# Altium schematic sheet MVM_AFE.SchDoc: Title
size 420 x 297 mm; Author: G.Kasprowicz; CompanyName: WUT ISE; DrawnBy: G.Kasprowicz; Organization: WUT ISE; Address1: PW ISE; Address2: Nowowiejska 15/19 00-665 Warsaw; Address3: gkasprow@gmail.com; Revision: 2; SheetNumber: 5; SheetTotal: 5; ModifiedBy: -; CheckedDate: -; Title2: Title 2; DivGrp: WUT ISE; Designer: G.Kasprowicz; ModifiedDate: -; ProjectName: Sensor Box
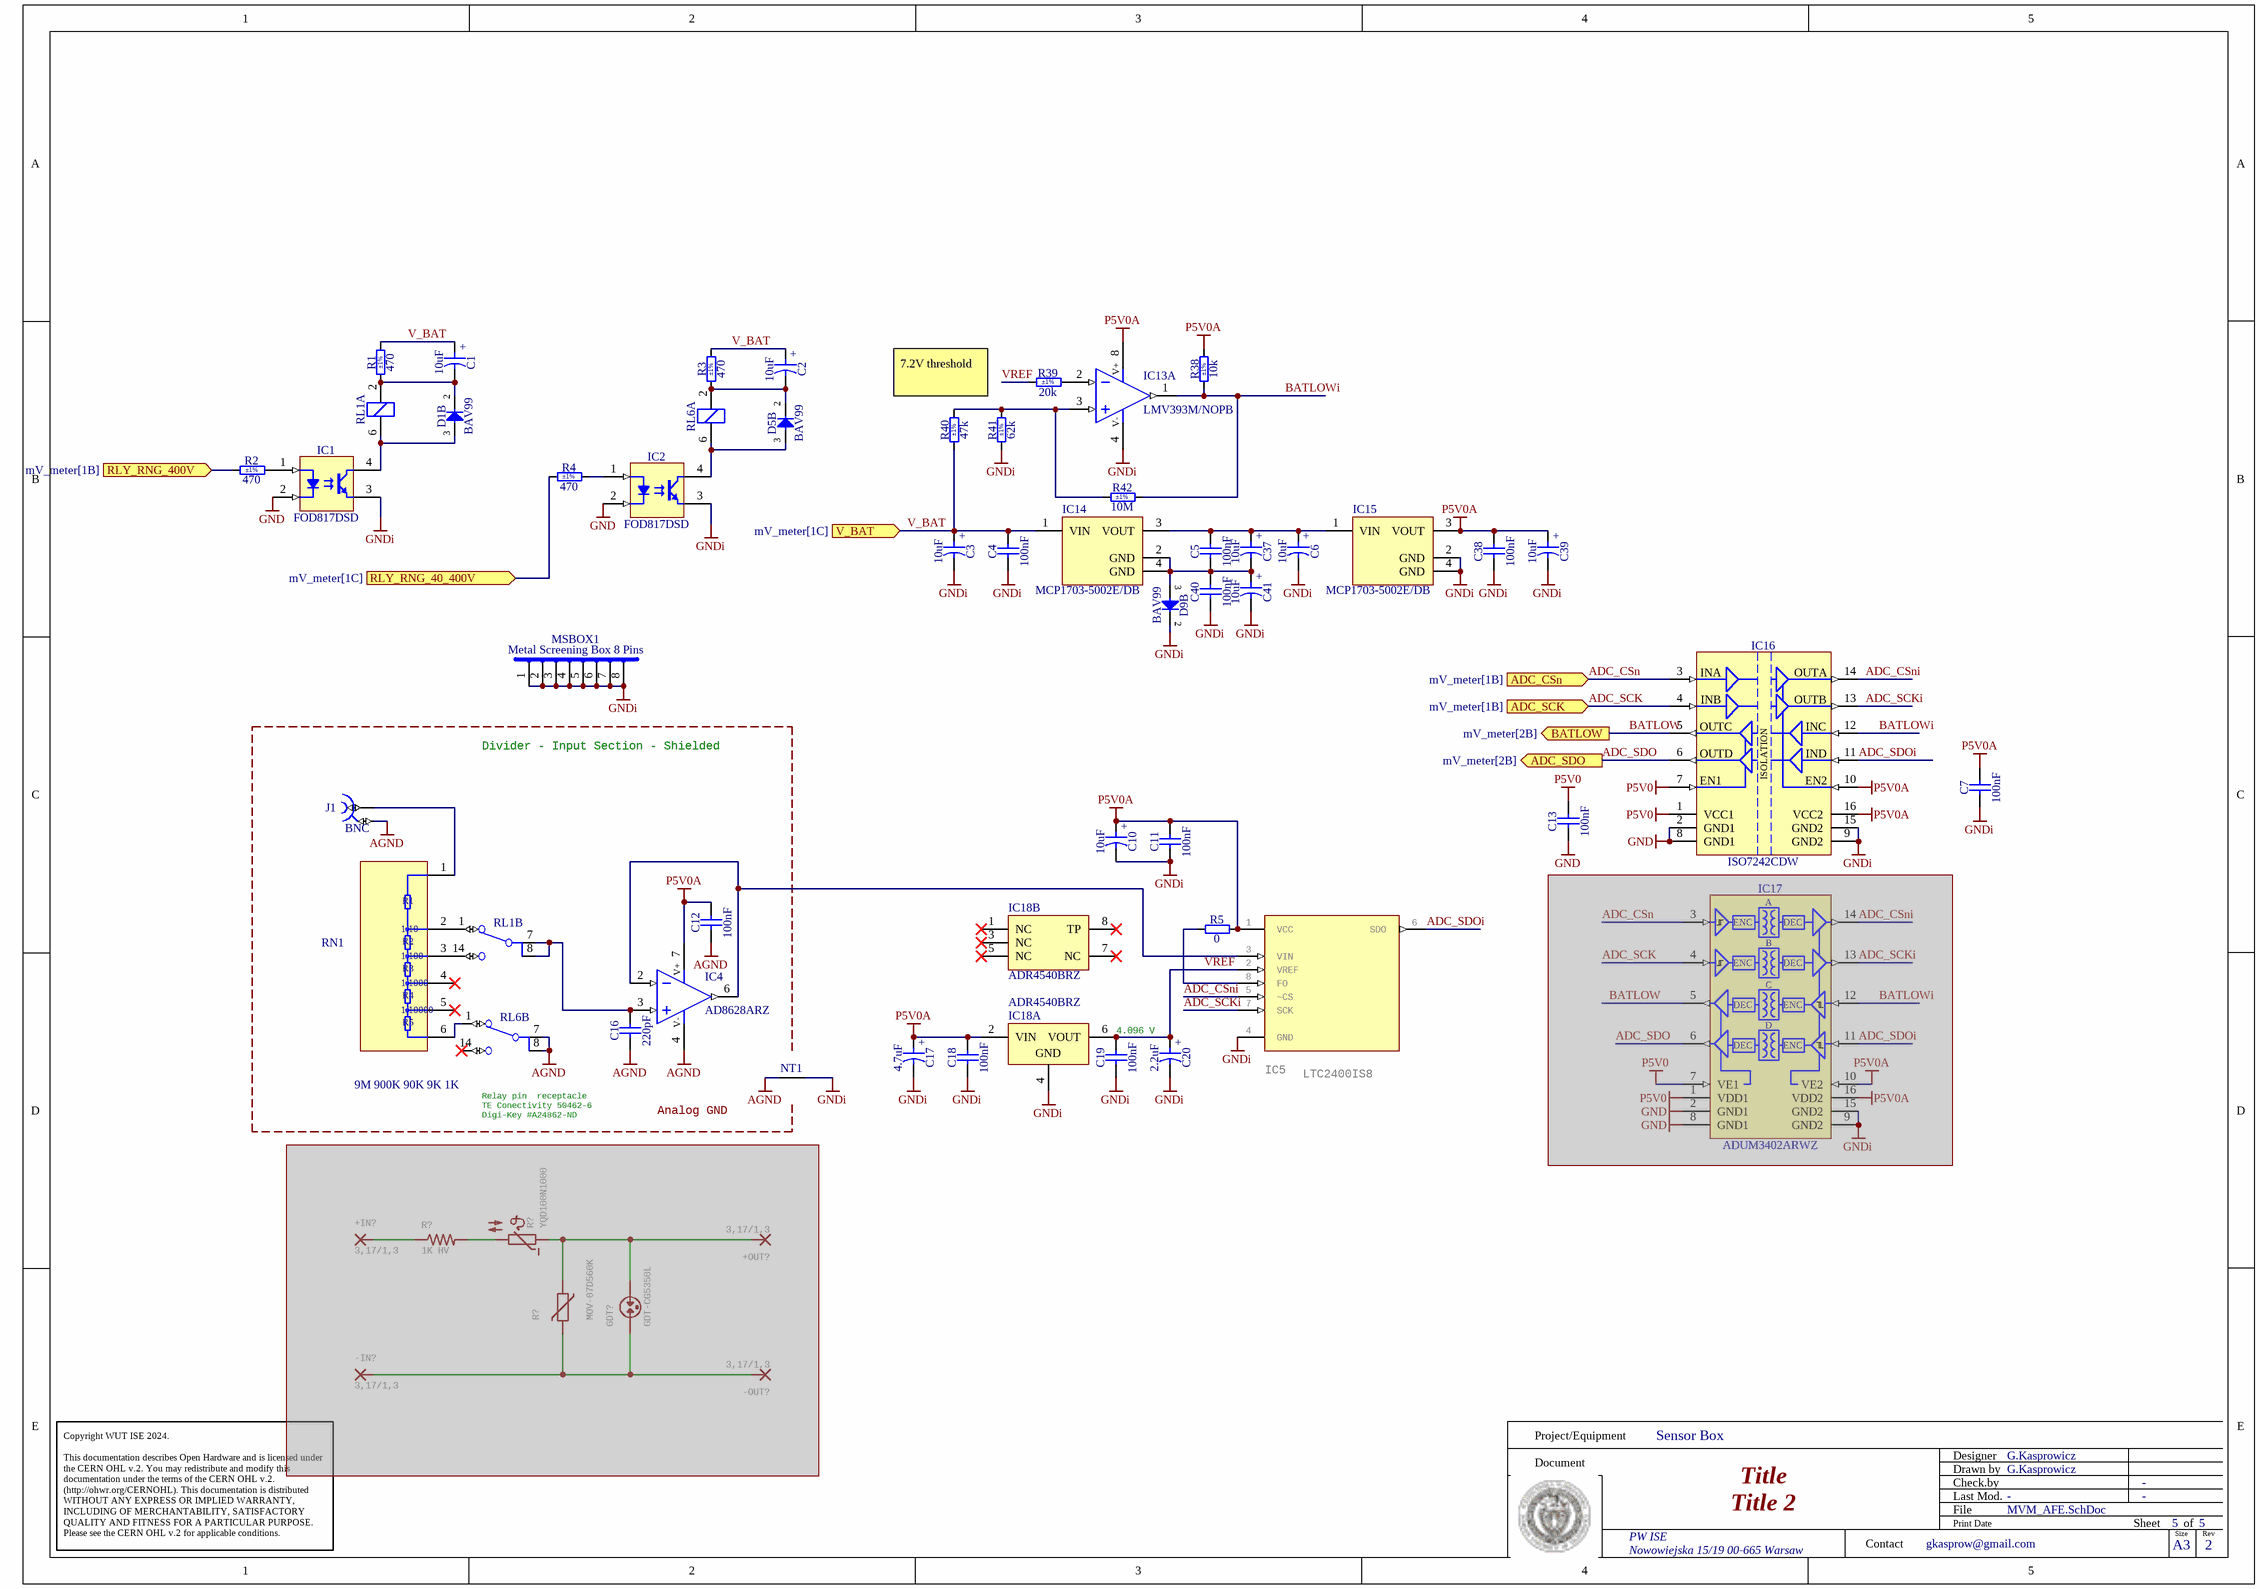
[diagram p0: MVM_AFE.SchDoc]

## Parts
(Parts that share a designator on the sheet are numbered #1, #2 ... from top to bottom, then left to right.)
+IN?  3,17/1,3  [3,17/1,3]  (masked out: inside a compile mask, not in the netlist)
+OUT?  3,17/1,3  [3,17/1,3]  (masked out: inside a compile mask, not in the netlist)
-IN?  3,17/1,3  [3,17/1,3]  (masked out: inside a compile mask, not in the netlist)
-OUT?  3,17/1,3  [3,17/1,3]  (masked out: inside a compile mask, not in the netlist)
C1  10uF  [CAPMP3216X180N]
C2  10uF  [CAPMP3216X180N]
C3  10uF  [CAPMP3216X180N]
C4  100nF  [CAPC2012X88N]
C5  100nF  [CAPC2012X88N]
C6  10uF  [CAPMP3216X180N]
C7  100nF  [CAPC2012X88N]
C10  10uF  [CAPMP3216X180N]
C11  100nF  [CAPC2012X88N]
C12  100nF  [CAPC2012X88N]
C13  100nF  [CAPC2012X88N]
C16  220pF  [CAPC2012X135N]
C17  4.7uF  [CAPMP3216X180N]
C18  100nF  [CAPC2012X88N]
C19  100nF  [CAPC2012X88N]
C20  2.2uF  [CAPMP3216X180N]
C37  10uF  [CAPMP3216X180N]
C38  100nF  [CAPC2012X88N]
C39  10uF  [CAPMP3216X180N]
C40  100nF  [CAPC2012X88N]
C41  10uF  [CAPMP3216X180N]
D1  BAV99  [SOT95P240X110-3N]  (part B of 2)
D5  BAV99  [SOT95P240X110-3N]  (part B of 2)
D9  BAV99  [SOT95P240X110-3N]  (part B of 2)
GDT?  GDT-CG5350L  [CG5350L]  (masked out: inside a compile mask, not in the netlist)
IC1  FOD817DSD  [FAIRCHILD_FOD817DSD]
IC2  FOD817DSD  [FAIRCHILD_FOD817DSD]
IC4  AD8628ARZ  [SOIC127P600X175-8N]
IC5  LTC2400IS8  [SOIC127P600X175-8N]
IC13  LMV393M/NOPB  [SOIC127P600X175-8N]  (part A of 2)
IC14  MCP1703-5002E/DB  [SOT-223-DB3_N]
IC15  MCP1703-5002E/DB  [SOT-223-DB3_N]
IC16  ISO7242CDW  [SOIC127P1030X265-16N]
IC17  ADUM3402ARWZ  [SOIC127P1032X265-16N]  (masked out: inside a compile mask, not in the netlist)
IC18  ADR4540BRZ  [ADI-R-8_M]  (parts A,B of 2)
J1  BNC  [TYCO_1-1337542-0]
MSBOX1  Metal Screening Box 8 Pins  [MSBOX_PERANCEA_PFL6T]
NT1  Net Tie  [Net Tie]  (value not drawn)  (net tie, no BOM)
R1  470  Tolerance: ±1%  [RESC2012X60N]
R2  470  Tolerance: ±1%  [RESC2012X60N]
R3  470  Tolerance: ±1%  [RESC2012X60N]
R4  470  Tolerance: ±1%  [RESC2012X60N]
R5  0  [RESC1608X55N]
R38  10k  Tolerance: ±1%  [RESC1608X55N]
R39  20k  Tolerance: ±1%  [RESC1608X55N]
R40  47k  Tolerance: ±1%  [RESC1608X55N]
R41  62k  Tolerance: ±1%  [RESC1608X55N]
R42  10M  Tolerance: ±1%  [RESC1608X55N]
R?#1  1K HV  [AXIAL-0.6]  (masked out: inside a compile mask, not in the netlist)
R?#2  YQD100N1000  [B57164]  (masked out: inside a compile mask, not in the netlist)
R?#3  MOV-07D560K  [S05K11]  (masked out: inside a compile mask, not in the netlist)
RL1  COMUS 3563.1231.051  [REL_LITTELFUSE_HE700]  (value not drawn)  (parts A,B of 2)
RL6  COMUS 3563.1231.051  [REL_LITTELFUSE_HE700]  (value not drawn)  (parts A,B of 2)
RN1  9M 900K 90K 9K 1K  [1776-C6815]

## Ports
ADC_CSn (in, see mV_meter[1B]), ADC_SCK (in, see mV_meter[1B]), ADC_SDO (out, see mV_meter[2B]), BATLOW (out, see mV_meter[2B]), RLY_RNG_40_400V (in, see mV_meter[1C]), RLY_RNG_400V (in, see mV_meter[1B]), V_BAT (in, see mV_meter[1C])

## Nets
AGND: C12.1 C16.1 IC4.4(V-) J1.2 NT1.1 RL6.7(C) RL6.8(C)
GND: C13.1 IC1.2(C) IC2.2(C) IC16.2(GND1) IC16.8(GND1)
GNDi: C3.2 C4.1 C6.2 C7.1 C10.2 C11.1 C17.2 C18.1 C19.1 C20.2 C38.1 C39.2 C40.1 C41.2 D9.2(C) IC1.3(E) IC2.3(E) IC5.4(GND) IC13.4(V-) IC15.2(GND) IC15.4(GND) IC16.9(GND2) IC16.15(GND2) IC18.4(GND) MSBOX1.1 MSBOX1.2 MSBOX1.3 MSBOX1.4 MSBOX1.5 MSBOX1.6 MSBOX1.7 MSBOX1.8 NT1.2 R41.1
P5V0: C13.2 IC16.1(VCC1) IC16.7(EN1)
P5V0A: C7.2 C10.1 C11.2 C12.2 C17.1 C18.2 C38.2 C39.1 IC4.7(V+) IC5.1(VCC) IC13.8(V+) IC15.3(VOUT) IC16.10(EN2) IC16.16(VCC2) IC18.2(VIN) R5.2 R38.2
ADC_CSn: IC16.3(INA) ; port ADC_CSn
ADC_CSni: IC5.5(~CS) IC16.14(OUTA)
ADC_SCK: IC16.4(INB) ; port ADC_SCK
ADC_SCKi: IC5.7(SCK) IC16.13(OUTB)
ADC_SDO: IC16.6(OUTD) ; port ADC_SDO
ADC_SDOi: IC5.6(SDO) IC16.11(IND)
BATLOW: IC16.5(OUTC) ; port BATLOW
BATLOWi: IC13.1(OUT) IC16.12(INC) R38.1 R42.2
RLY_RNG_40_400V: R4.1 ; port RLY_RNG_40_400V
RLY_RNG_400V: R2.1 ; port RLY_RNG_400V
V_BAT: C1.1 C2.1 C3.1 C4.2 IC14.1(VIN) R1.2 R3.2 R40.1 ; port V_BAT
VREF: C19.2 C20.1 IC5.2(VREF) IC18.6(VOUT) R39.1
NetC1_2: C1.2 D1.2(C) R1.1 RL1.2
NetC2_2: C2.2 D5.2(C) R3.1 RL6.2
NetC5_1: C5.1 C37.2 C40.2 C41.1 D9.3(COMAC) IC14.2(GND) IC14.4(GND)
NetC5_2: C5.2 C6.1 C37.1 IC14.3(VOUT) IC15.1(VIN)
NetC16_2: C16.2 IC4.3(IN+) RL1.7(C) RL1.8(C)
NetD1_3: D1.3(COMAC) IC1.4(C) RL1.6
NetD5_3: D5.3(COMAC) IC2.4(C) RL6.6
NetIC1_1: IC1.1(A) R2.2
NetIC2_1: IC2.1(A) R4.2
NetIC4_2: IC4.2(IN-) IC4.6(OUT) IC5.3(VIN)
NetIC5_8: IC5.8(FO) R5.1
NetIC13_2: IC13.2(IN-) R39.2
NetIC13_3: IC13.3(IN+) R40.2 R41.2 R42.1
NetJ1_1: J1.1 RN1.1
NetRL1_1: RL1.1(NC) RN1.2
NetRL1_14: RL1.14(NO) RN1.3
NetRL6_1: RL6.1(NC) RN1.6

Not connected (* = marked no-connect by the designer): IC18 1(NC)* 3(NC)* 5(NC)* 7(NC)* 8(TP)*; RL6 14(NO)*; RN1 4* 5*

## Notes on the sheet
- 7.2V threshold
- Divider - Input Section - Shielded
- 4.096 V
- Relay pin  receptacle
  TE Conectivity 50462-6
  Digi-Key #A24862-ND
- Analog GND
- Project/Equipment
- Document
- Designer
- Drawn by
- Check.by
- Copyright WUT ISE 2024.
  This documentation describes Open Hardware and is licensed under the CERN OHL v.2. You may redistribute and modify this documentation under the terms of the CERN OHL v.2. (http://ohwr.org/CERNOHL). This documentation is distributed WITHOUT ANY EXPRESS OR IMPLIED WARRANTY, INCLUDING OF MERCHANTABILITY, SATISFACTORY QUALITY AND FITNESS FOR A PARTICULAR PURPOSE. Please see the CERN OHL v.2 for applicable conditions.
- Contact
- File
- Last Mod.
- Print Date
- Sheet
- Size
- A3
- of
- Rev
- (in symbol ADUM3402ARWZ_a) A; ENC; DEC; B; C; D
- (in symbol CTE3216-18_2.2UF_25V_10%) +
- (in symbol CTE3216-18_4.7UF_10V_10%_LESR1400) +
- (in symbol CTE3216-18_10UF_10V_10%_LESR1800) +
- (in symbol ISO7242CDW) ISOLATION
- (in symbol RN_9M_900k_90k_9k_1k_CADDOCK_1776-C6815) R1; 1/10; R2; 1/100; R3; 1/1000; R4; 1/10000; R5

## Library data of the parts
+IN? +OUT? -IN? -OUT? = 3,17/1,3: THROUGH-HOLE PAD; GateName_1: 1; SymbolName_1: PAD; LibraryName: wirepad; DeviceSetName: 3,17/1,3
C1-C3 C6 C10 C37 C39 C41 = CTE3216-18_10UF_10V_10%_LESR1800: Polarised capacitor; Part Description: Low ESR 1R8 Solid Tantalum Chip Capacitor; Manufacturer: GENERIC; Manufacturer1 Part Number: TPSA106K010R1800; Voltage: 10V; Tolerance: ±10%; Part Number: CTE3216-18_10UF_10V_10%_LESR1800; Component Kind: Standard; Component Type: Standard; Pin Count: 2; Value: 10uF; Status: Preferred; Manufacturer Part Number: CTE3216-18_10UF_10V_10%_LESR1800; Case: A; Mounted: Yes; Socket: No; SMD: Yes; Sense: No; Manufacturer1 Example: AVX; Manufacturer1 ComponentHeight: 1.8mm; HelpURL: \\cern.ch\dfs\Applications\Altium\Datasheets\CTE-LESR_AVX_TPS.pdf; Author: CERN DEM JLC; CreateDate: 05.05.2008; LatestRevisionDate: 20.01.2009
C4 C5 C7 C11-C13 C18 C19 C38 C40 = CC0805_100NF_50V_1%_NP0: Non-polarised capacitor; Part Description: SMD Multilayer Chip Ceramic Capacitor; Manufacturer: GENERIC; Manufacturer1 Part Number: 0805N103F500C; Voltage: 50V; TC: C0G/NP0; Tolerance: ±1%; Part Number: CC0805_100NF_50V_1%_NP0; Component Kind: Standard; Component Type: Standard; Footprint: CAPC2012X135N; Pin Count: 2; Value: 100nF; Status: Not Recommended; Manufacturer Part Number: CC0805_100NF_50V_1%_NP0; Case: 0805; Mounted: Yes; Socket: No; SMD: Yes; Sense: No; ComponentHeight: 1.35mm; Manufacturer1 Example: WALSIN TECHNOLOGY CORPORATION; Manufacturer1 ComponentHeight: 1.35mm; HelpURL: \\cern.ch\dfs\Applications\Altium\Datasheets\CC0805_WALSIN_0805.pdf; Author: CERN DEM HF; CreateDate: 28.08.2023; LatestRevisionDate: 28.08.2023
C16 = CC0805_220PF_50V_5%_C0G: Non-polarised capacitor; Part Description: SMD Multilayer Chip Ceramic Capacitor; Manufacturer: GENERIC; Manufacturer1 Part Number: C0805C151J5GACTU; Voltage: 50V; TC: C0G/NP0; Tolerance: ±5%; Part Number: CC0805_220PF_50V_5%_C0G; Component Kind: Standard; Component Type: Standard; Pin Count: 2; Value: 220pF; Status: Preferred; Manufacturer Part Number: CC0805_220PF_50V_5%_C0G; Case: 0805; Mounted: Yes; Socket: No; SMD: Yes; Sense: No; Manufacturer1 Example: KEMET; Manufacturer1 ComponentHeight: 0.88mm; HelpURL: \\cern.ch\dfs\Applications\Altium\Datasheets\CC0805_C0G_KEMET_(Commercial Grade).pdf; Author: CERN DEM JLC; CreateDate: 03.12.2007; LatestRevisionDate: 22.04.2015
C17 = CTE3216-18_4.7UF_10V_10%_LESR1400: Polarised capacitor; Part Description: Low ESR 1R4 Solid Tantalum Chip Capacitor; Manufacturer: GENERIC; Manufacturer1 Part Number: TPSA475K010R1400; Voltage: 10V; Tolerance: ±10%; Part Number: CTE3216-18_4.7UF_10V_10%_LESR1400; Component Kind: Standard; Component Type: Standard; Pin Count: 2; Value: 4.7uF; Status: Preferred; Manufacturer Part Number: CTE3216-18_4.7UF_10V_10%_LESR1400; Case: A; Mounted: Yes; Socket: No; SMD: Yes; Sense: No; Manufacturer1 Example: AVX; Manufacturer1 ComponentHeight: 1.8mm; HelpURL: \\cern.ch\dfs\Applications\Altium\Datasheets\CTE-LESR_AVX_TPS.pdf; Author: CERN DEM JLC; CreateDate: 05.05.2008; LatestRevisionDate: 20.01.2009
C20 = CTE3216-18_2.2UF_25V_10%: Polarised capacitor; Part Description: Solid Tantalum Chip Capacitor; Manufacturer: GENERIC; Manufacturer1 Part Number: TAJA225K025R; Voltage: 25V; Tolerance: ±10%; Part Number: CTE3216-18_2.2UF_25V_10%; Component Kind: Standard; Component Type: Standard; Pin Count: 2; Value: 2.2uF; Status: Preferred; Manufacturer Part Number: CTE3216-18_2.2UF_25V_10%; Case: A; Mounted: Yes; Socket: No; SMD: Yes; Sense: No; Manufacturer1 Example: AVX; Manufacturer1 ComponentHeight: 1.8mm; HelpURL: \\cern.ch\dfs\Applications\Altium\Datasheets\CTE_AVX_TAJ.pdf; Author: CERN DEM JLC; CreateDate: 26.05.2008; LatestRevisionDate: 26.05.2008
D1 D5 D9 = BAV99: Serial Diode; Part Description: Dual Series Signal Diode; Manufacturer: FAIRCHILD SEMICONDUCTOR; Voltage: 70V; Power: 350mW; PressFit: No; Bonding: No; Part Number: BAV99; Component Kind: Standard; Component Type: Standard; Device: BAV99; PackageDescription: SOT, 0.95mm Pitch; 3 Pin, 1.40mm W X 3.00mm L X 1.10mm H body, IPC Medium Density; Manufacturer Part Number: BAV99; Pin Count: 3; Case: SOT23-3; Mounted: Yes; Socket: No; SMD: Yes; Sense: No; ComponentHeight: 1.1mm; HelpURL: \\cern.ch\dfs\Applications\Altium\Datasheets\BAV99.pdf; Author: CERN DEM JLC; CreateDate: 06.05.2008; LatestRevisionDate: 27.09.2012
GDT? = GDT-CG5350L: GAS DISCHARGE TUBE; GateName_1: G$1; SymbolName_1: GDT; DeviceSetName: GDT-; DeviceName: CG5350L; LibraryName: supressor
IC1 IC2 = FOD817DSD: Single Optocoupler; Part Description: 4-Pin High Operating Temperature Phototransistor Optocoupler; Manufacturer: FAIRCHILD SEMICONDUCTOR; PressFit: No; Bonding: No; Part Number: FOD817DSD; Component Kind: Standard; Component Type: Standard; Device: FOD817DSD; PackageDescription: SOIC, 2.54mm Pitch; 4 Pin, 6.50mm W X 4.60mm L X 4.60mm H body; Manufacturer Part Number: FOD817DSD; Pin Count: 4; Case: SOIC4; Mounted: Yes; Socket: No; SMD: Yes; Sense: No; ComponentHeight: 4.6mm; HelpURL: \\cern.ch\dfs\Applications\Altium\Datasheets\FOD817DSD.pdf; Author: CERN DEM JLC; CreateDate: 21.07.2014; LatestRevisionDate: 21.07.2014
IC4 = AD8628ARZ: Operational Amplifier; Part Description: Zero-Drift, Single-Supply, Rail-to-Rail Input/Output Operational Amplifier; Manufacturer: ANALOG DEVICES; PressFit: No; Bonding: No; Part Number: AD8628ARZ; Component Kind: Standard; Component Type: Standard; Device: AD8628ARZ; PackageDescription: SOIC 8, Pitch 1.27mm - Body 4x5mm, IPC Medium Density; Manufacturer Part Number: AD8628AR; Pin Count: 8; Case: SOIC8; Mounted: Yes; Socket: No; SMD: Yes; Sense: No; ComponentHeight: 1.75mm; Author: CERN DEM JMW; HelpURL: \\cern.ch\dfs\Applications\Altium\Datasheets\AD8628ARZ.pdf; CreateDate: 30.11.2009; LatestRevisionDate: 29.03.2022
IC5 = ADC_LTC2400IS8PBF: 24-Bit μPower / No Latency ∆ΣTM ADC in SO-8; Manufacturer: Analog Devices; MPN: LTC2400IS8#PBF; GateName_1: A; PartNumber: LTC2400IS8PBF; LibraryName: LTC_By_element14_Batch_1; DeviceSetName: LTC2400IS8PBF; OC_FARNELL: 1500953; OC_NEWARK: 56M5404; PACKAGE: SOIC-8; SUPPLIER: Linear Technology
IC13 = LMV393M/NOPB: Dual Operational Amplifier; Part Description: Dual General Purpose, Low Voltage, Tiny Pack Comparator; Manufacturer: TEXAS INSTRUMENTS; PressFit: No; Bonding: No; Part Number: LMV393M/NOPB; Component Kind: Standard; Component Type: Standard; Device: LMV393M/NOPB; PackageDescription: SOIC 8, Pitch 1.27mm - Body 4x5mm, IPC Medium Density; Manufacturer Part Number: LMV393M; Pin Count: 8; Case: SOIC8; Mounted: Yes; Socket: No; SMD: Yes; Sense: No; ComponentHeight: 1.75mm; Author: CERN DEM JLC; HelpURL: \\cern.ch\dfs\Applications\Altium\Datasheets\LMV393M-NOPB.pdf; CreateDate: 29.11.2012; LatestRevisionDate: 01.06.2022
IC14 IC15 = CMP-0136-00522-1: 250 mA, 16V, Low Quiescent Current LDO Regulator, 3-Pin SOT-223, Extended Temperature; PackageReference: SOT-223-DB3; PackageVersion: revBB, Aug-2009; DatasheetVersion: revD, Sep-2009; PackageDescription: 3-Lead Plastic Small Outline Transistor (DB) [SOT-223]
IC16 = ISO7242CDW: Quad Channel (Two Channels in Each Direction), 150Mbps, Digital Isolator; Part Description: Quad Channel (2/2 Channel Directionality), 25Mbps, Digital Isolator; Manufacturer: TEXAS INSTRUMENTS; PressFit: No; Bonding: No; Part Number: ISO7242CDW; Component Kind: Standard; Component Type: Standard; Device: ISO7242CDW; PackageDescription: SOIC, 1.27mm Pitch; 16 Pin, 7.50mm W X 10.3mm L X 2.65mm H body, IPC Medium Density; Manufacturer Part Number: ISO7242CDW; Pin Count: 16; Case: SOIC16W; Mounted: Yes; Socket: No; SMD: Yes; Sense: No; ComponentHeight: 2.65mm; Author: CERN DEM HF; HelpURL: \\cern.ch\dfs\Applications\Altium\Datasheets\ISO724XX.pdf; CreateDate: 25.10.2022; LatestRevisionDate: 25.10.2022
IC17 = ADUM3402ARWZ_a: Quad-Channel, Digital Isolators, Enhanced System-Level ESD Reliability; Manufacturer: ANALOG DEVICES; PressFit: No; Bonding: No; Part Number: ADUM3402ARWZ_a; Component Kind: Standard; Component Type: Standard; Device: ADUM3402ARWZ; PackageDescription: SOIC, 1.27mm Pitch; 16 pin, 7.50mm W X 10.4mm L X 2.65mm H body, IPC Medium Density; Part Description: Quad-Channel, Digital Isolators, Enhanced System-Level ESD Reliability; Manufacturer Part Number: ADUM3402ARW; Pin Count: 16; Case: SOIC16W; Mounted: Yes; Socket: No; SMD: Yes; Sense: No; ComponentHeight: 2.65mm; Author: CERN DEM JLC; HelpURL: \\cern.ch\dfs\Applications\Altium\Datasheets\ADUM3402ARWZ.pdf; CreateDate: 10.10.2011; LatestRevisionDate: 25.03.2022
IC18 = CMP-0784-00192-1: Ultralow Noise, High Accuracy Voltage Reference, 4.096 V Output, 3 to 15 V Supply, Industrial, 8-pin SOIC (R-8), Tube; Manufacturer: Analog Devices; Max V Supply (V): 15; Min V Supply (V): 3; Vout: 4.096V; Ref Out TC (ppm/C): 2; ComponentLink4URL: Product URL:http://www.analog.com/en/special-linear-functions/voltage-references/adr4540/products/product.html; Mounting Technology: Surface Mount; ComponentLink1Description: Manufacturer URL; PackageDescription: 8-Pin Standard Small Outline Package, Body 4.9 x 3.9 mm, Pitch 1.27 mm; ComponentLink2URL: http://www.analog.com/static/imported-files/data_sheets/ADR4520_4525_4530_4533_4540_4550.pdf; ComponentLink1URL: http://www.analog.com/en/index.html; DatasheetVersion: Rev. 0; ComponentLink4Description: URL Link1; Operating Temp Range: -40 to 125 degC; PartNumber: ADR4540BRZ; ComponentLink2Description: Datasheet; ComponentLink3URL: http://www.analog.com/static/imported-files/packages/PKG_PDF/SOIC_Narrow%20(R)/R_8.pdf; ComponentLink3Description: Package Specification; PackageVersion: 060506-A, 06/2006; Packing: Tube; PackageReference: R-8; Code_JEDEC: MS-012-AA
J1 = TYCO_1-1337542-0: Part Description: 50 Ohms  BNC Elbow PCB Socket with Mounting Posts; Manufacturer: TYCO ELECTRONICS; PressFit: No; Part Number: TYCO_1-1337542-0; Component Kind: Standard; Component Type: Standard; Pin Count: 2; Family: BNC; Mounted: Yes; Socket: No; SMD: No; Sense: No; Status: None; Manufacturer Part Number: 1-1337542-0; ComponentHeight: 13.16mm; HelpURL: \\cern.ch\dfs\Applications\Altium\Datasheets\TYCO_1-1337542-0.pdf; Author: CERN DEM JLC; CreateDate: 02.02.2012; LatestRevisionDate: 02.02.2012
MSBOX1 = MSBOX_PERANCEA_PFL6T: Part Description: Metal Screening Box, Internal dimensions L50 x W50 x H15mm, Overall Size 55x55x16mm (No 8 pins); Manufacturer Part Number: PFL6T; PressFit: No; Part Number: MSBOX_PERANCEA_PFL6T; Component Kind: Standard; Component Type: Standard; Pin Count: 8; PackageDescription: Metal Screening Box, Internal dimensions L50 x W50 x H15mm, Overall Size 55x55x16mm; Mounted: Yes; Socket: No; SMD: No; Sense: No; Status: None; Manufacturer: PERANCEA; ComponentHeight: 16mm; HelpURL: \\cern.ch\dfs\Applications\Altium\Datasheets\MSBOX_PERANCEA_PFL6T.pdf; Author: CERN DEM JLC; CreateDate: 08.12.2008; LatestRevisionDate: 08.12.2008
NT1 = Net Tie: Part Description: Net Tie (2 Nets); Mounted: No; Part Number: Net Tie; Component Type: Net Tie; Pin Count: 2; Family: Net Tie; Socket: No; SMD: No; Sense: No; Status: None; ComponentHeight: 0mm; HelpURL: Undefined; Author: CERN DEM JLC; CreateDate: 22.03.2011; LatestRevisionDate: 22.03.2011; PackageDescription: 2 Plated Through Hole For Coaxial Cable Link: Hole Dia.=1.4mm Pad Dia.=2.5mm
R1-R4 = R0805_470R_1%_0.125W_100PPM: Resistor - 1%; Part Description: General Purpose Thick Film Chip Resistor; Manufacturer: GENERIC; Manufacturer1 Part Number: NRC10F4700TRF; Power: 0.125W; TC: ±100ppm/°C; PressFit: No; Part Number: R0805_470R_1%_0.125W_100PPM; Component Kind: Standard; Component Type: Standard; Pin Count: 2; Value: 470; Status: Preferred; Manufacturer Part Number: R0805_470R_1%_0.125W_100PPM; Case: 0805; Mounted: Yes; Sense: No; Socket: No; SMD: Yes; Manufacturer1 Example: NIC COMPONENT; Manufacturer1 ComponentHeight: 0.6mm; HelpURL: \\cern.ch\dfs\Applications\Altium\Datasheets\R0805_NIC_NRC.pdf; Author: CERN DEM JLC; CreateDate: 03.12.2007; LatestRevisionDate: 13.03.2008
R5 = R0603_0R_JUMPER: Resistor; Part Description: 1A (0.05R Max DC Resistance) Zero Ohm Jumper; Manufacturer: GENERIC; Manufacturer1 Part Number: NRC06Z0; PressFit: No; Part Number: R0603_0R_JUMPER; Component Kind: Standard; Component Type: Standard; Pin Count: 2; Value: 0; Status: Preferred; Manufacturer Part Number: R0603_0R_JUMPER; Case: 0603; Mounted: Yes; Sense: No; Socket: No; SMD: Yes; Manufacturer1 Example: NIC COMPONENT; Manufacturer1 ComponentHeight: 0.55mm; HelpURL: \\cern.ch\dfs\Applications\Altium\Datasheets\R0603_NIC_NRC.pdf; Author: CERN DEM JLC; CreateDate: 03.12.2007; LatestRevisionDate: 13.03.2008
R38 = R0603_10K_1%_0.1W_100PPM: Resistor - 1%; Part Description: General Purpose Thick Film Chip Resistor; Manufacturer: GENERIC; Manufacturer1 Part Number: NRC06F1002TRF; Power: 0.1W; TC: ±100ppm/°C; PressFit: No; Part Number: R0603_10K_1%_0.1W_100PPM; Component Kind: Standard; Component Type: Standard; Pin Count: 2; Value: 10k; Status: Preferred; Manufacturer Part Number: R0603_10K_1%_0.1W_100PPM; Case: 0603; Mounted: Yes; Sense: No; Socket: No; SMD: Yes; Manufacturer1 Example: NIC COMPONENT; Manufacturer1 ComponentHeight: 0.55mm; HelpURL: \\cern.ch\dfs\Applications\Altium\Datasheets\R0603_NIC_NRC.pdf; Author: CERN DEM JLC; CreateDate: 03.12.2007; LatestRevisionDate: 13.03.2008
R39 = R0603_20K_1%_0.1W_100PPM: Resistor - 1%; Part Description: General Purpose Thick Film Chip Resistor; Manufacturer: GENERIC; Manufacturer1 Part Number: NRC06F2002TRF; Power: 0.1W; TC: ±100ppm/°C; PressFit: No; Part Number: R0603_20K_1%_0.1W_100PPM; Component Kind: Standard; Component Type: Standard; Pin Count: 2; Value: 20k; Status: Preferred; Manufacturer Part Number: R0603_20K_1%_0.1W_100PPM; Case: 0603; Mounted: Yes; Sense: No; Socket: No; SMD: Yes; Manufacturer1 Example: NIC COMPONENT; Manufacturer1 ComponentHeight: 0.55mm; HelpURL: \\cern.ch\dfs\Applications\Altium\Datasheets\R0603_NIC_NRC.pdf; Author: CERN DEM JLC; CreateDate: 03.12.2007; LatestRevisionDate: 13.03.2008
R40 = R0603_47K_1%_0.1W_100PPM: Resistor - 1%; Part Description: General Purpose Thick Film Chip Resistor; Manufacturer: GENERIC; Manufacturer1 Part Number: NRC06F4702TRF; Power: 0.1W; TC: ±100ppm/°C; PressFit: No; Part Number: R0603_47K_1%_0.1W_100PPM; Component Kind: Standard; Component Type: Standard; Pin Count: 2; Value: 47k; Status: Preferred; Manufacturer Part Number: R0603_47K_1%_0.1W_100PPM; Case: 0603; Mounted: Yes; Sense: No; Socket: No; SMD: Yes; Manufacturer1 Example: NIC COMPONENT; Manufacturer1 ComponentHeight: 0.55mm; HelpURL: \\cern.ch\dfs\Applications\Altium\Datasheets\R0603_NIC_NRC.pdf; Author: CERN DEM JLC; CreateDate: 03.12.2007; LatestRevisionDate: 13.03.2008
R41 = R0603_62K_1%_0.1W_100PPM: Resistor - 1%; Part Description: General Purpose Thick Film Chip Resistor; Manufacturer: GENERIC; Manufacturer1 Part Number: NRC06F6202TRF; Power: 0.1W; TC: ±100ppm/°C; PressFit: No; Part Number: R0603_62K_1%_0.1W_100PPM; Component Kind: Standard; Component Type: Standard; Pin Count: 2; Value: 62k; Status: Preferred; Manufacturer Part Number: R0603_62K_1%_0.1W_100PPM; Case: 0603; Mounted: Yes; Sense: No; Socket: No; SMD: Yes; Manufacturer1 Example: NIC COMPONENT; Manufacturer1 ComponentHeight: 0.55mm; HelpURL: \\cern.ch\dfs\Applications\Altium\Datasheets\R0603_NIC_NRC.pdf; Author: CERN DEM JLC; CreateDate: 03.12.2007; LatestRevisionDate: 13.03.2008
R42 = R0603_10M_1%_0.1W_100PPM: Resistor - 1%; Part Description: General Purpose Thick Film Chip Resistor; Manufacturer: GENERIC; Manufacturer1 Part Number: CRCW060310M0FKEA; Power: 0.1W; TC: ±100ppm/°C; PressFit: No; Part Number: R0603_10M_1%_0.1W_100PPM; Component Kind: Standard; Component Type: Standard; Pin Count: 2; Value: 10M; Status: Preferred; Manufacturer Part Number: R0603_10M_1%_0.1W_100PPM; Case: 0603; Mounted: Yes; Sense: No; Socket: No; SMD: Yes; Manufacturer1 Example: VISHAY; Manufacturer1 ComponentHeight: 0.55mm; HelpURL: \\cern.ch\dfs\Applications\Altium\Datasheets\R0603_VISHAY_CRCW e3.pdf; Author: CERN DEM JLC; CreateDate: 12.01.2017; LatestRevisionDate: 12.01.2017
R?#1 = RESISTORPTH-1W: ResistorBasic schematic elements and footprints for 0603, 1206, and PTH resistors.; GateName_1: G$1; DeviceName: PTH-1W; SymbolName_1: RESISTOR; LibraryName: SparkFun-Resistors; DeviceSetName: RESISTOR
R?#2 = B57164: SIEMENS NTC; MPN: B57164K474K52; GateName_1: 1; SymbolName_1: NTC; LibraryName: ptc-ntc; DeviceSetName: B57164; MF: MF; OC_FARNELL: 9753451; OC_NEWARK: 29M3118
R?#3 = VARISTORS05K11: VARISTOR; GateName_1: G$1; SymbolName_1: VARISTOR; DeviceName: S05K11; LibraryName: varistor; DeviceSetName: VARISTOR
RL1 RL6 = REL_COMUS_3563.1231.051: SPDT-CO (1 Form C) Miniature Dual In-line Reed Relay; Part Description: 0.25A/100VDC  SPDT-CO (1 Form C) Miniature Dual In-line Reed Relay; PressFit: No; Value: 5VDC; Part Number: REL_COMUS_3563.1231.051; Component Kind: Standard; Component Type: Standard; Pin Count: 8; PackageDescription: DIP 14, 8 Leads, Row Spacing 7.62 mm, Pitch 2.54 mm, Height 5.82mm; Mounted: Yes; Socket: No; SMD: No; Sense: No; Status: None; Manufacturer: COMUS; Manufacturer Part Number: 3563.1231.051; ComponentHeight: 5.5mm; HelpURL: \\cern.ch\dfs\Applications\Altium\Datasheets\REL_LITTELFUSE_HE721C2400.pdf; Author: GK; CreateDate: 23.01.2018; LatestRevisionDate: 01.02.2018
RN1 = RN_9M_900k_90k_9k_1k_CADDOCK_1776-C6815: Ultra-Precision Voltage Dividers 1776 Series; Power: 31mW; TC: ±5ppm/°C; Tolerance: ±0.1%; Voltage: 1200V; PressFit: No; Part Number: RN_9M_900k_90k_9k_1k_CADDOCK_1776-C6815; Component Kind: Standard; Component Type: Standard; Pin Count: 5; Value: 9M 900K 90K 9K 1K; Status: None; Part Description: Ultra-Precision Voltage Dividers 1776 Series; Manufacturer: CADDOCK; Manufacturer Part Number: 1776-C6815; Mounted: Yes; Socket: No; SMD: No; Sense: No; ComponentHeight: 15.5mm; HelpURL: \\cern.ch\dfs\Applications\Altium\Datasheets\RN_CADDOCK_HVD.pdf; Author: GK; CreateDate: 27.04.2023; LatestRevisionDate: 27.04.2023